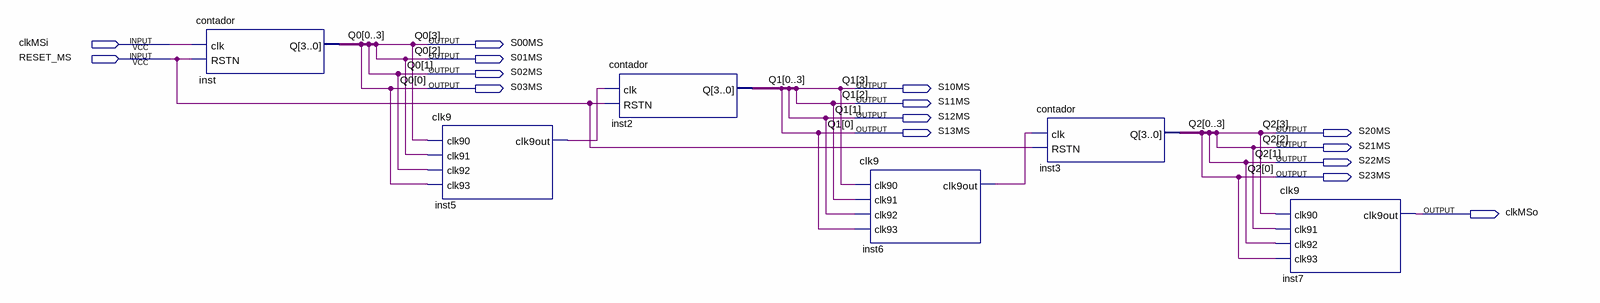
[diagram p0: schematic sheet]
// Quartus schematic contMS.bdf as structural Verilog: 6 symbols, 15 pins
module contMS (
  input  clkMSi,
  input  RESET_MS,
  output S00MS,
  output S01MS,
  output S02MS,
  output S03MS,
  output S10MS,
  output S11MS,
  output S12MS,
  output S13MS,
  output S20MS,
  output S21MS,
  output S22MS,
  output S23MS,
  output clkMSo
);

  wire inst5_clk9out, inst6_clk9out;

  contador inst (.clk(clkMSi), .RSTN(RESET_MS), .Q({S03MS, S02MS, S01MS, S00MS}));
  clk9 inst5 (.clk90(S00MS), .clk91(S01MS), .clk92(S02MS), .clk93(S03MS), .clk9out(inst5_clk9out));
  contador inst2 (.clk(inst5_clk9out), .RSTN(RESET_MS), .Q({S13MS, S12MS, S11MS, S10MS}));
  clk9 inst6 (.clk90(S10MS), .clk91(S11MS), .clk92(S12MS), .clk93(S13MS), .clk9out(inst6_clk9out));
  contador inst3 (.clk(inst6_clk9out), .RSTN(RESET_MS), .Q({S23MS, S22MS, S21MS, S20MS}));
  clk9 inst7 (.clk90(S20MS), .clk91(S21MS), .clk92(S22MS), .clk93(S23MS), .clk9out(clkMSo));

  // Other names for the same wires on the sheet: Q0[3:0] = {S00MS, S01MS, S02MS, S03MS};
  //   Q1[3:0] = {S10MS, S11MS, S12MS, S13MS}; Q2[3:0] = {S20MS, S21MS, S22MS, S23MS}
endmodule
